# EAGLE design Curret_Detector_V2 (EAGLE 8.5.1)
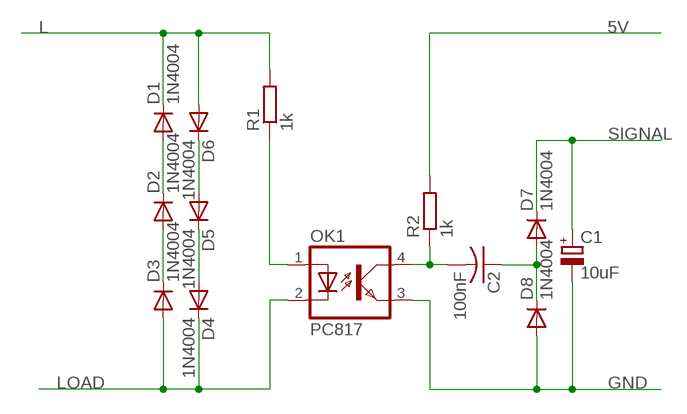
[diagram p0: schematic, sheet 1]

## Parts
C1  10uF  CPOL-EUE2.5-7  [E2,5-7]
C2  100nF  C-US050-035X075  [C050-035X075]
D1  1N4004  [DO41-10]
D2  1N4004  [DO41-10]
D3  1N4004  [DO41-10]
D4  1N4004  [DO41-10]
D5  1N4004  [DO41-10]
D6  1N4004  [DO41-10]
D7  1N4004  [DO41-10]
D8  1N4004  [DO41-10]
OK1  PC817  [DIL04]
R1  1k  R-EU_0207/10  [0207/10]
R2  1k  R-EU_0207/10  [0207/10]

## Nets
5V: R2.2
GND: C1.- D8.A OK1.3(EMIT)
L: D1.C D6.A R1.2
LOAD: D3.A D4.C OK1.2(C)
N$1: D2.A D3.C
N$2: D1.A D2.C
N$3: C2.2 OK1.4(COL) R2.1
N$4: C2.1 D7.A D8.C
N$5: D5.A D6.C
N$6: D4.A D5.C
N$9: OK1.1(A) R1.1
SIGNAL: C1.+ D7.C

## Library data of the parts
C1 = rcl:CPOL-EU: POLARIZED CAPACITOR, European symbol; SPICEPREFIX: C
C2 = rcl:C-US: CAPACITOR, American symbol; SPICEPREFIX: C
D1-D8 = adafruit:1N4004: DIODE General purpose 1N400x type rectifier (With bigger pads) http://www.ladyada.net/library/pcb/eaglelibrary.html
OK1 = optocoupler-2:PC817: SHARP OPTO COUPLER
R1 R2 = rcl:R-EU_: RESISTOR, European symbol

## Board
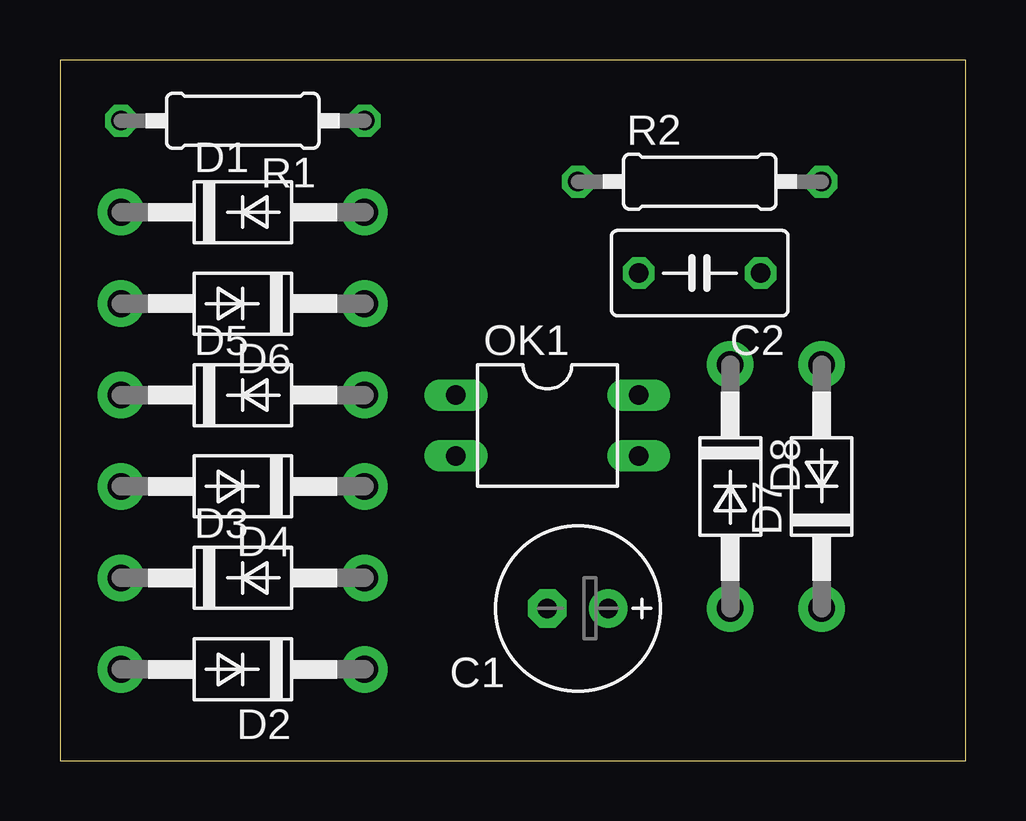
[diagram p1: board, top side]
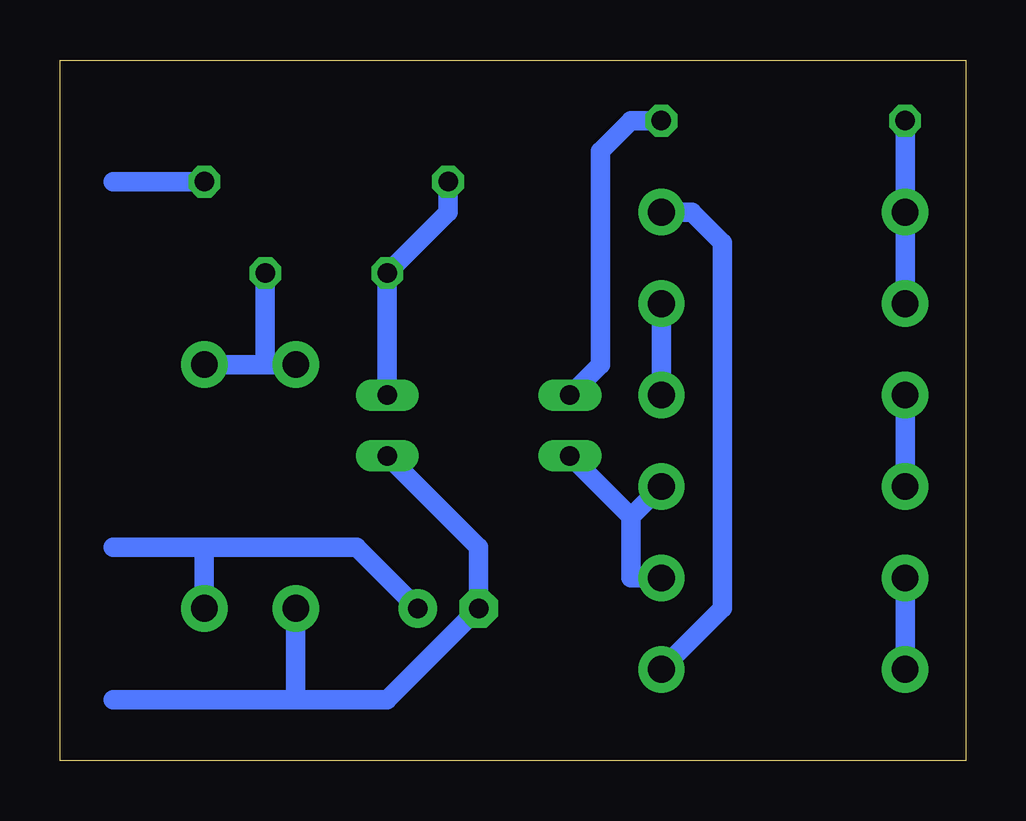
[diagram p2: board, bottom side, seen from below]

Size 37.77 x 29.2 mm. Coordinates in mm from the lower left corner, seen from the top.
Outline: 0,0 37.77,0 37.77,29.2 0,29.2 0,0
Copper layers (1*16): Top 0.035mm / dielectric 1.5mm / Bottom 0.035mm
Design rules "default": minimum track width 6mil, minimum drill 0.35mm, track to track 6mil, track to pad 6mil, pad to pad 6mil, via to via 6mil, smd to smd 6mil, copper to edge 40mil, drill to drill 6mil, minimum pad ring 10mil, minimum via ring 8mil, stop-mask expansion 4mil, vias tented up to drill 0mil, thermal gap 10mil

### Footprints (pad centres in the part's own frame; a part is rotated, then mirrored left to right if it is on the bottom)
E2,5-7 = drill 0.813 pad 1.6: + -1.27,0 | drill 0.813 pad 1.6 octagon: - 1.27,0
C050-035X075 = drill 0.813 octagon: 1 -2.54,0; 2 2.54,0
DO41-10 = drill 1.118 pad 1.93: A 5.08,0; C -5.08,0
DIL04 = drill 0.813 long: 1 -1.27,-3.81; 2 1.27,-3.81; 3 1.27,3.81; 4 -1.27,3.81
0207/10 = drill 0.813 octagon: 1 -5.08,0; 2 5.08,0

### Placement (x,y rotation side)
C1  21.59,6.35 180 top
C2  26.67,20.32 180 top
D1  7.62,22.86 0 top
D2  7.62,3.81 180 top
D3  7.62,7.62 0 top
D4  7.62,11.43 180 top
D5  7.62,15.24 0 top
D6  7.62,19.05 180 top
D7  31.75,11.43 90 top
D8  27.94,11.43 270 top
OK1  20.32,13.97 270 top
R1  7.62,26.67 180 top
R2  26.67,24.13 0 top

### Tracks (layer width: path | path; a pad name or v marks a point on that pad's centre or on a via)
5V
  Bottom 0.813: R2.2 35.56,24.13
GND
  Bottom 0.813: 27.94,2.54 24.13,2.54 C1.- 20.32,8.89 OK1.3 | 27.94,2.54 35.56,2.54 | D8.A 27.94,2.54
L
  Bottom 0.813: R1.2 D1.C D6.A
LOAD
  Bottom 0.813: D3.A 13.97,7.62 13.97,10.16 | 13.97,10.16 D4.C | OK1.2 13.97,10.16
N$1
  Bottom 0.813: D3.C D2.A
N$2
  Bottom 0.813: D1.A 11.43,22.86 10.16,21.59 10.16,6.35 D2.C
N$3
  Bottom 0.813: OK1.4 C2.2 21.59,22.86 R2.1
N$4
  Bottom 0.813: D7.A 29.21,16.51 | 29.21,16.51 D8.C | C2.1 29.21,16.51
N$5
  Bottom 0.813: D5.A D6.C
N$6
  Bottom 0.813: D5.C D4.A
N$9
  Bottom 0.813: OK1.1 15.24,16.51 15.24,25.4 13.97,26.67 R1.1
SIGNAL
  Bottom 0.813: C1.+ 25.4,8.89 30.48,8.89 31.75,8.89 | 31.75,8.89 D7.C | 31.75,8.89 35.56,8.89